# Altium schematic sheet OUTPUT.SchDoc
size A4
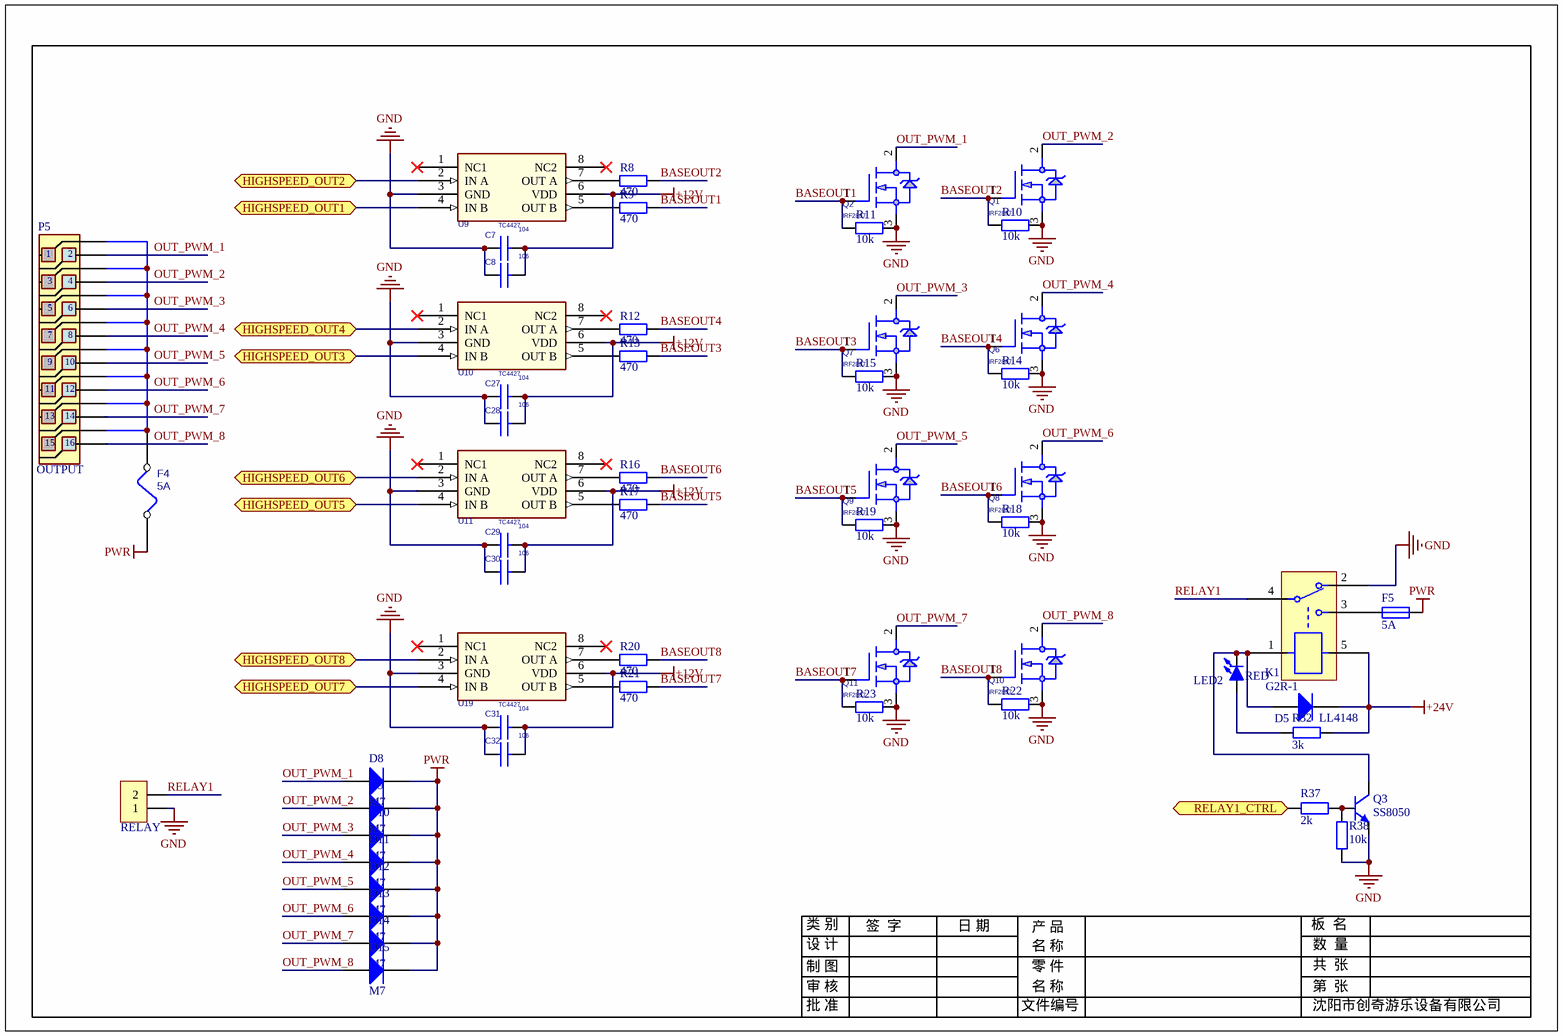
[diagram p0: OUTPUT.SchDoc]

## Parts
C7  104  [C 0805]
C8  106  [C 0805]
C27  104  [C 0805]
C28  106  [C 0805]
C29  104  [C 0805]
C30  106  [C 0805]
C31  104  [C 0805]
C32  106  [C 0805]
D5  LL4148  [MINI_MELF (LL34)]
D8  M7  [SMA]
D9  M7  [SMA]
D10  M7  [SMA]
D11  M7  [SMA]
D12  M7  [SMA]
D13  M7  [SMA]
D14  M7  [SMA]
D15  M7  [SMA]
F4  5A  [FUSEe-CAR]
F5  5A  [FUSEe-CAR]
K1  G2R-1  [RELAY_OMRON_G2R]
LED2  RED  [LED 3MM-R]
P5  OUTPUT  [557-2x8]
Q1  IRF2807  [TO220A]
Q2  IRF2807  [TO220A]
Q3  SS8050  [SOT23-3N]
Q6  IRF2807  [TO220A]
Q7  IRF2807  [TO220A]
Q8  IRF2807  [TO220A]
Q9  IRF2807  [TO220A]
Q10  IRF2807  [TO220A]
Q11  IRF2807  [TO220A]
R8  470  [R 0805]
R9  470  [R 0805]
R10  10k  [R 0805]
R11  10k  [R 0805]
R12  470  [R 0805]
R13  470  [R 0805]
R14  10k  [R 0805]
R15  10k  [R 0805]
R16  470  [R 0805]
R17  470  [R 0805]
R18  10k  [R 0805]
R19  10k  [R 0805]
R20  470  [R 0805]
R21  470  [R 0805]
R22  10k  [R 0805]
R23  10k  [R 0805]
R32  3k  [R 0805]
R37  2k  [R 0805]
R38  10k  [R 0805]
RELAY  AUX  [557-2X1]  (value not drawn)
U9  TC4427  [SO8]
U10  TC4427  [SO8]
U11  TC4427  [SO8]
U19  TC4427  [SO8]

## Ports
HIGHSPEED_OUT1 (bidir), HIGHSPEED_OUT2 (bidir), HIGHSPEED_OUT3 (bidir), HIGHSPEED_OUT4 (bidir), HIGHSPEED_OUT5 (bidir), HIGHSPEED_OUT6 (bidir), HIGHSPEED_OUT7 (bidir), HIGHSPEED_OUT8 (bidir), RELAY1_CTRL (bidir)

## Nets
+12V: C7.2 C8.2 C27.2 C28.2 C29.2 C30.2 C31.2 C32.2 U9.6(VDD) U10.6(VDD) U11.6(VDD) U19.6(VDD)
+24V: D5.2 K1.5 R32.1
GND: C7.1 C8.1 C27.1 C28.1 C29.1 C30.1 C31.1 C32.1 K1.2 Q1.3(S) Q2.3(S) Q3.2(E) Q6.3(S) Q7.3(S) Q8.3(S) Q9.3(S) Q10.3(S) Q11.3(S) R10.2 R11.2 R14.2 R15.2 R18.2 R19.2 R22.2 R23.2 R38.2 RELAY.1 U9.3(GND) U10.3(GND) U11.3(GND) U19.3(GND)
PWR: D8.2 D9.2 D10.2 D11.2 D12.2 D13.2 D14.2 D15.2 F4.1 F5.2
BASEOUT1: Q2.1(G) R9.2 R11.1
BASEOUT2: Q1.1(G) R8.2 R10.1
BASEOUT3: Q7.1(G) R13.2 R15.1
BASEOUT4: Q6.1(G) R12.2 R14.1
BASEOUT5: Q9.1(G) R17.2 R19.1
BASEOUT6: Q8.1(G) R16.2 R18.1
BASEOUT7: Q11.1(G) R21.2 R23.1
BASEOUT8: Q10.1(G) R20.2 R22.1
HIGHSPEED_OUT1: U9.4(IN_B) ; port HIGHSPEED_OUT1
HIGHSPEED_OUT2: U9.2(IN_A) ; port HIGHSPEED_OUT2
HIGHSPEED_OUT3: U10.4(IN_B) ; port HIGHSPEED_OUT3
HIGHSPEED_OUT4: U10.2(IN_A) ; port HIGHSPEED_OUT4
HIGHSPEED_OUT5: U11.4(IN_B) ; port HIGHSPEED_OUT5
HIGHSPEED_OUT6: U11.2(IN_A) ; port HIGHSPEED_OUT6
HIGHSPEED_OUT7: U19.4(IN_B) ; port HIGHSPEED_OUT7
HIGHSPEED_OUT8: U19.2(IN_A) ; port HIGHSPEED_OUT8
OUT_PWM_1: D8.1 P5.2 Q2.2(D)
OUT_PWM_2: D9.1 P5.4 Q1.2(D)
OUT_PWM_3: D10.1 P5.6 Q7.2(D)
OUT_PWM_4: D11.1 P5.8 Q6.2(D)
OUT_PWM_5: D12.1 P5.10 Q9.2(D)
OUT_PWM_6: D13.1 P5.12 Q8.2(D)
OUT_PWM_7: D14.1 P5.14 Q11.2(D)
OUT_PWM_8: D15.1 P5.16 Q10.2(D)
RELAY1: K1.4 RELAY.2
RELAY1_CTRL: R37.2 ; port RELAY1_CTRL
NetD5_1: D5.1 K1.1 LED2.2(K) Q3.3(C)
NetF4_2: F4.2 P5.1 P5.3 P5.5 P5.7 P5.9 P5.11 P5.13 P5.15
NetF5_1: F5.1 K1.3
NetLED2_1: LED2.1(A) R32.2
NetQ3_1: Q3.1(B) R37.1 R38.1
NetR8_1: R8.1 U9.7(OUT_A)
NetR9_1: R9.1 U9.5(OUT_B)
NetR12_1: R12.1 U10.7(OUT_A)
NetR13_1: R13.1 U10.5(OUT_B)
NetR16_1: R16.1 U11.7(OUT_A)
NetR17_1: R17.1 U11.5(OUT_B)
NetR20_1: R20.1 U19.7(OUT_A)
NetR21_1: R21.1 U19.5(OUT_B)

Not connected (* = marked no-connect by the designer): U9 1(NC1)* 8(NC2)*; U10 1(NC1)* 8(NC2)*; U11 1(NC1)* 8(NC2)*; U19 1(NC1)* 8(NC2)*

## Notes on the sheet
- 设 计
- 制 图
- 审 核
- 类 别
- 签  字
- 日 期
- 产 品
- 名 称
- 零 件
- 板  名
- 数  量
- 共  张
- 第  张
- 批 准
- 文件编号
- 沈阳市创奇游乐设备有限公司

## Library data of the parts
C7 C8 C27-C32 = CAP NP
D5 D8-D15 = Diode
F4 = FUSE
F5 = FUSE1: Fuse
K1 = Relay2
LED2 = LED-SMD: 贴片LED; 版权归属: 源创客; BOM名称: 贴片LED; 学习资源: www.ooocke.com
P5 = 557-2x8: 接插件
Q1 Q2 Q6-Q11 = MOSFET N-Channel
Q3 = 8050-SMD: 高频放大-NPN型; 版权归属: 源创客; 属性: 40V 1.5A 1W 100MHZ; BOM名称: 高频放大-NPN型; 学习资源: www.ooocke.com
R8-R23 = Res1
R32 R37 R38 = R: 贴片电阻; 版权归属: 源创客; BOM名称: 贴片电阻; 学习资源: www.ooocke.com
RELAY = Header 2: 2P接插件; 版权归属: 源创客; BOM名称: 2P接插件; 学习资源: www.ooocke.com
U9-U11 U19 = TC4427EPA